# EAGLE design iridium-9602-breakout (EAGLE 9.2.2)
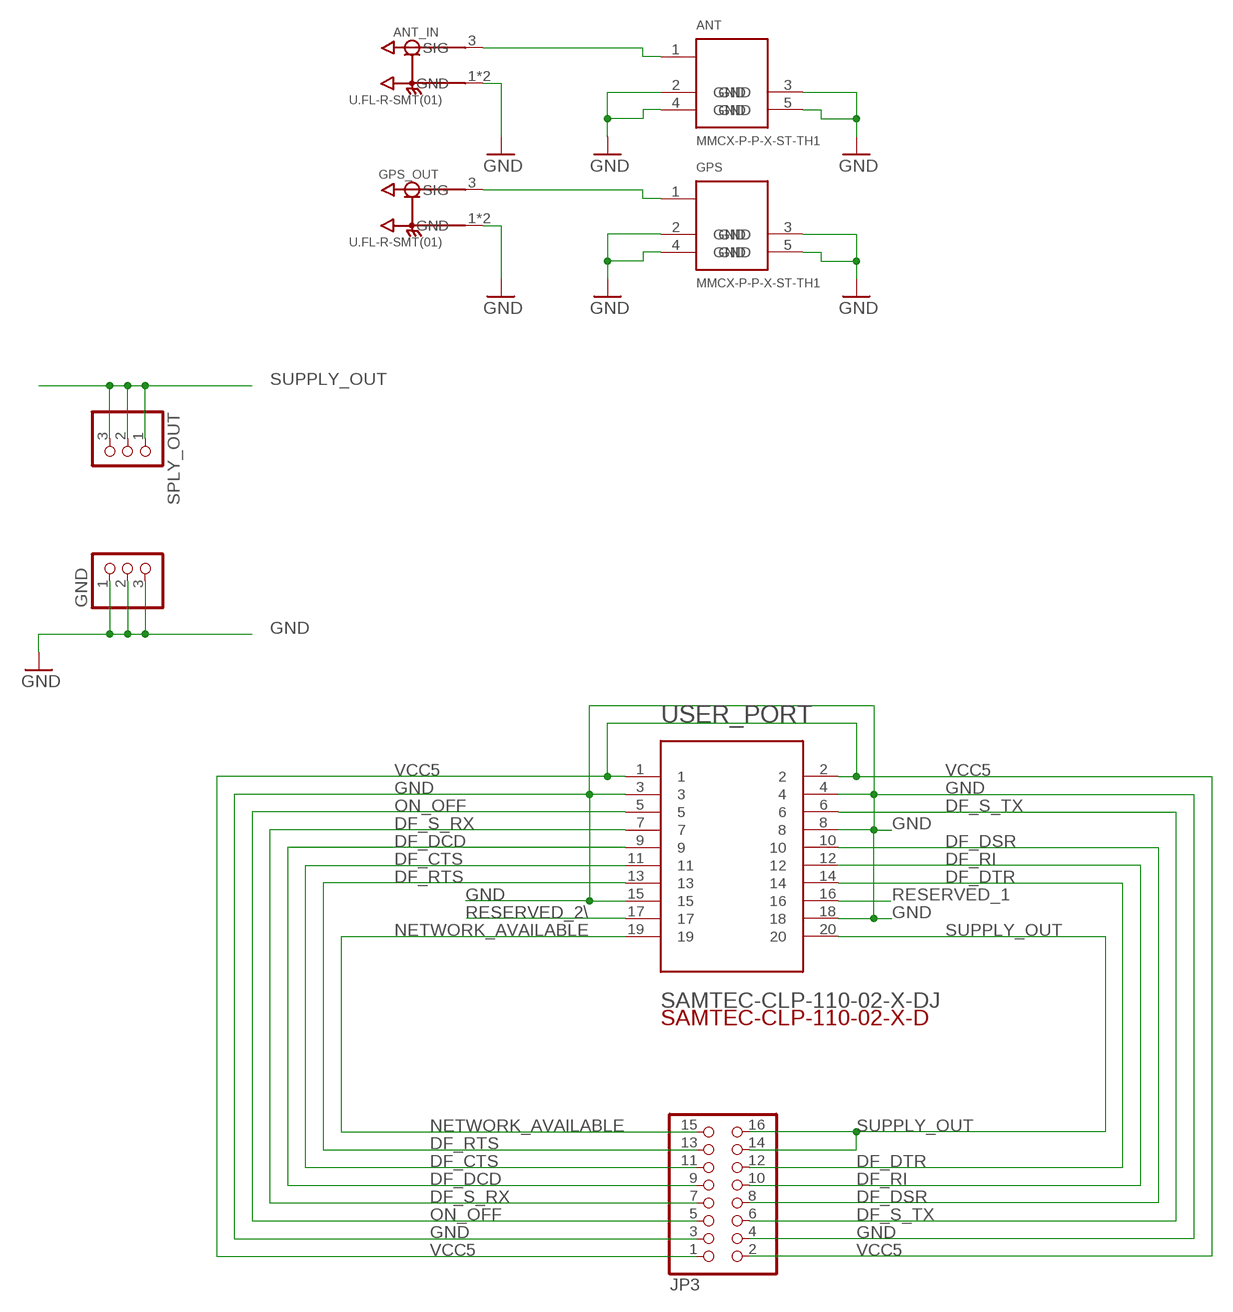
[diagram p0: schematic, sheet 1]

## Parts
ANT  MMCX-P-P-X-ST-TH1  [MMCX-P-P-X-ST-TH1]
ANT_IN  U.FL-R-SMT(01)  [HRS_U.FL-R-SMT(01)]
GND  PINHD-1X3  [1X03]
GPS  MMCX-P-P-X-ST-TH1  [MMCX-P-P-X-ST-TH1]
GPS_OUT  U.FL-R-SMT(01)  [HRS_U.FL-R-SMT(01)]
JP3  PINHD-2X8  [2X08]
SPLY_OUT  PINHD-1X3  [1X03]
USER_PORT  SAMTEC-CLP-110-02-X-DJ  [SAMTEC-CLP-110-02-X-D]

## Nets
DF_CTS: JP3.11 USER_PORT.11
DF_DCD: JP3.9 USER_PORT.9
DF_DSR: JP3.8 USER_PORT.10
DF_DTR: JP3.12 USER_PORT.14
DF_RI: JP3.10 USER_PORT.12
DF_RTS: JP3.13 USER_PORT.13
DF_S_RX: JP3.7 USER_PORT.7
DF_S_TX: JP3.6 USER_PORT.6
GND [power]: ANT.2(GND) ANT.3(GND) ANT.4(GND) ANT.5(GND) ANT_IN.1(GND) ANT_IN.2(GND) GND.1 GND.2 GND.3 GPS.2(GND) GPS.3(GND) GPS.4(GND) GPS.5(GND) GPS_OUT.1(GND) GPS_OUT.2(GND) JP3.3 JP3.4 USER_PORT.3 USER_PORT.4 USER_PORT.8 USER_PORT.15 USER_PORT.18
N$21 [rf]: ANT.1 ANT_IN.3(SIG)
N$22 [rf]: GPS.1 GPS_OUT.3(SIG)
NETWORK_AVAILABLE: JP3.15 USER_PORT.19
ON_OFF: JP3.5 USER_PORT.5
RESERVED_1: USER_PORT.16
RESERVED_2\: USER_PORT.17
SUPPLY_OUT: JP3.14 JP3.16 SPLY_OUT.1 SPLY_OUT.2 SPLY_OUT.3 USER_PORT.20
VCC5 [power]: JP3.1 JP3.2 USER_PORT.1 USER_PORT.2

## Library data of the parts
ANT GPS = MMCX-P-P-X-ST-TH1:MMCX-P-P-X-ST-TH1: MMCX STRAIGHT,THROUGH HOLE PLUG - 50 OHM.; DESCRIPTION: Conn MMCX PL 0Hz to 6GHz 50Ohm Solder ST Thru-Hole Gold Over Nickel; DIGI-KEY_PART_NUMBER: SAM10618-ND; DIGI-KEY_PURCHASE_URL: https://www.digikey.ru/product-detail/en/samtec-inc/MMCX-P-P-H-ST-TH1/SAM10618-ND/6561612?utm_source=snapeda&utm_medium=aggregator&utm_campaign=symbol; MF: Samtec Inc.; MP: MMCX-P-P-H-ST-TH1; PACKAGE: None
ANT_IN GPS_OUT = U.FL-R-SMT_01_:U.FL-R-SMT(01): U.FL Series 6 Ghz 50 Ohm Ultra-small SMT Coaxial Cable Receptacle; DESCRIPTION: U.FL Series 6 Ghz 50 Ohm Ultra-small SMT Coaxial Cable Receptacle; DIGI-KEY_PART_NUMBER: H9161-ND; DIGI-KEY_PURCHASE_URL: https://www.digikey.ru/product-detail/en/hirose-electric-co-ltd/U.FL-R-SMT_01_/H9161-ND/513010?utm_source=snapeda&utm_medium=aggregator&utm_campaign=symbol; MF: Hirose; MP: U.FL-R-SMT_01_; PACKAGE: None
GND SPLY_OUT = pinhead:PINHD-1X3: PIN HEADER
JP3 = pinhead:PINHD-2X8: PIN HEADER
USER_PORT = SAMTEC-CLP-110-02-X-D:SAMTEC-CLP-110-02-X-D; DESCRIPTION: .050 Tiger Claw™ Rugged Reliable Dual Wipe Socket Strip; DIGI-KEY_PART_NUMBER: CLP-110-02-L-D-K-ND; DIGI-KEY_PURCHASE_URL: https://www.digikey.ru/product-detail/en/samtec-inc/CLP-110-02-L-D-K/CLP-110-02-L-D-K-ND/6693709?utm_source=snapeda&utm_medium=aggregator&utm_campaign=symbol; MF: Samtec Inc.; MP: CLP-110-02-L-D-K; PACKAGE: None

## Net classes
0 default: width 0.2 mm, clearance 0.2 mm
1 power: width 0.5 mm, clearance 0.2 mm
2 rf: width 0.5 mm, clearance 0.065 mm

## Board
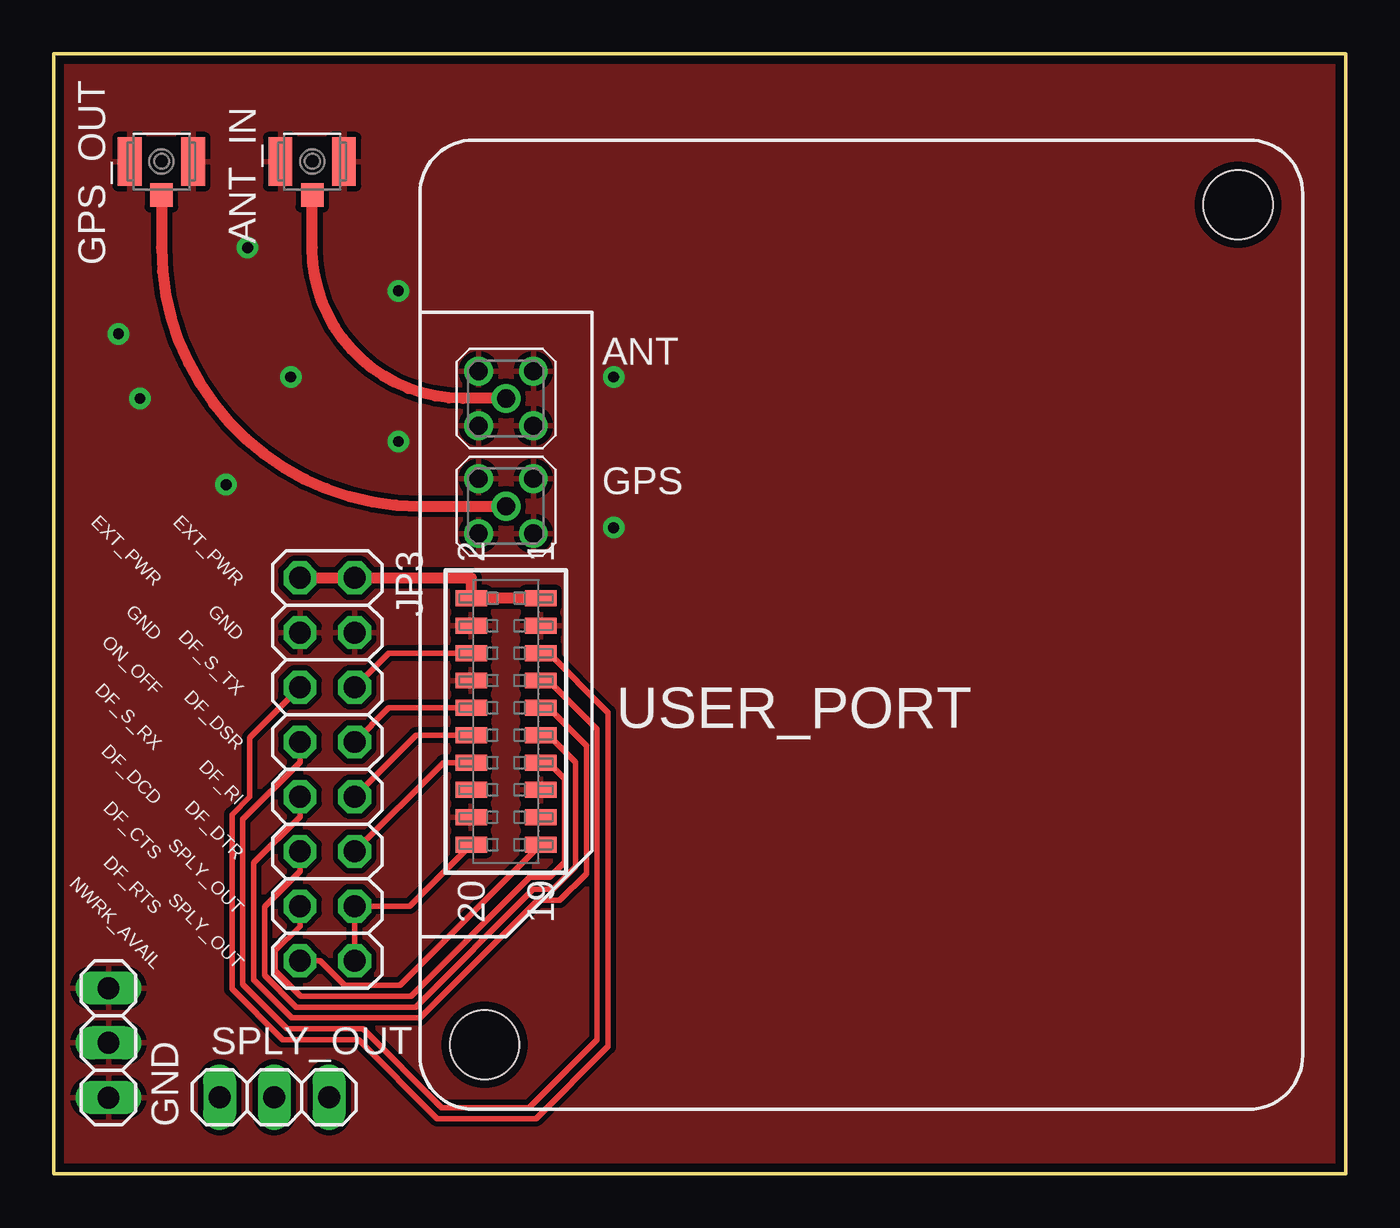
[diagram p1: board, top side]
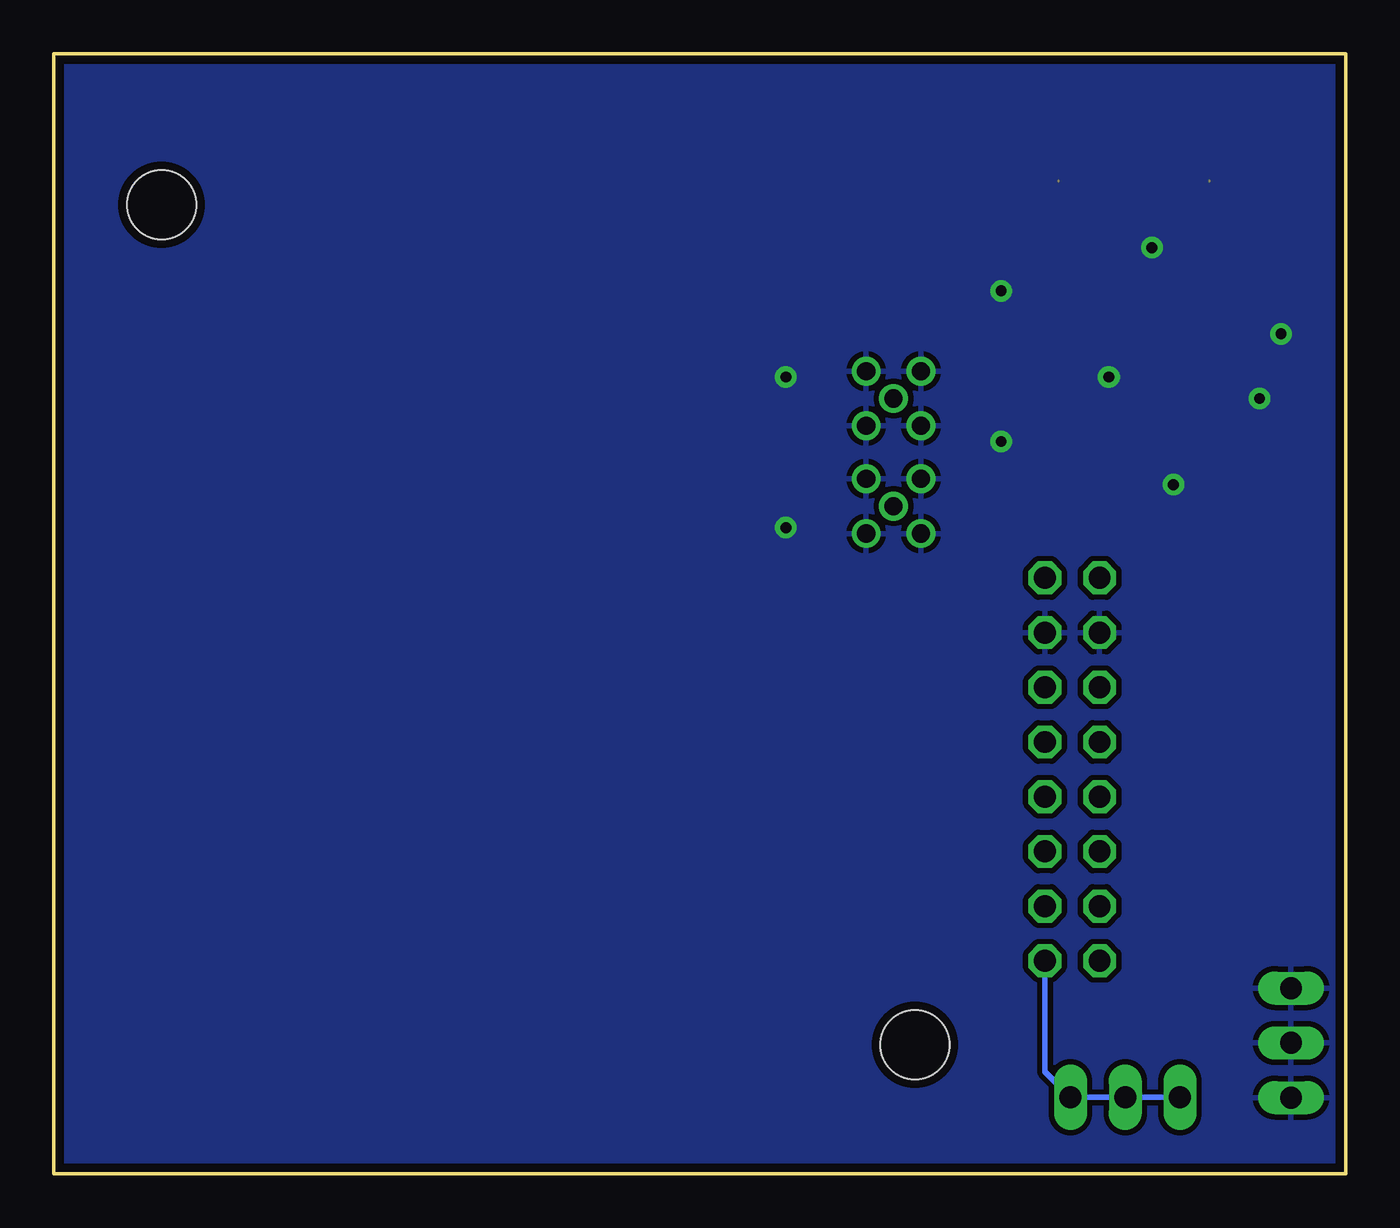
[diagram p2: board, bottom side, seen from below]

Size 60 x 52 mm. Coordinates in mm from the lower left corner, seen from the top.
Outline: 0,52 60,52 60,0 0,0 0,52
Copper layers (1*16): Top 0.035mm / dielectric 1mm / Bottom 0.035mm
Design rules "rezonit *": minimum track width 0.2mm, minimum drill 0.5mm, track to track 0.25mm, track to pad 0.25mm, pad to pad 0.25mm, via to via 0.25mm, smd to smd 0.2mm, copper to edge 0.4mm, drill to drill 0.4mm, minimum pad ring 0.25mm, minimum via ring 0.25mm, stop-mask expansion 4mil, vias tented up to drill 0mil, thermal gap 10mil
Holes 3.2 mm at 20,6 55,45

### Footprints (pad centres in the part's own frame; a part is rotated, then mirrored left to right if it is on the bottom)
MMCX-P-P-X-ST-TH1 = drill 0.84 pad 1.3: 1 0,0; 2 -1.27,1.27; 3 -1.27,-1.27; 4 1.27,1.27; 5 1.27,-1.27
HRS_U.FL-R-SMT(01) = smd 1.1 x 2.25: 1 -1.475,0; 2 1.475,0 | smd 1.05 x 1.1: 3 0,-1.55
1X03 = drill 1.016 long: 1 -2.54,0; 2 0,0; 3 2.54,0
2X08 = drill 1.016 octagon: 1 -8.89,-1.27; 2 -8.89,1.27; 3 -6.35,-1.27; 4 -6.35,1.27; 5 -3.81,-1.27; 6 -3.81,1.27; 7 -1.27,-1.27; 8 -1.27,1.27; 9 1.27,-1.27; 10 1.27,1.27; 11 3.81,-1.27; 12 3.81,1.27; 13 6.35,-1.27; 14 6.35,1.27; 15 8.89,-1.27; 16 8.89,1.27
SAMTEC-CLP-110-02-X-D = smd 0.74 x 1.47: 1 -5.715,1.613; 2 -5.715,-1.613; 3 -4.445,1.613; 4 -4.445,-1.613; 5 -3.175,1.613; 6 -3.175,-1.613; 7 -1.905,1.613; 8 -1.905,-1.613; 9 -0.635,1.613; 10 -0.635,-1.613; 11 0.635,1.613; 12 0.635,-1.613; 13 1.905,1.613; 14 1.905,-1.613; 15 3.175,1.613; 16 3.175,-1.613; 17 4.445,1.613; 18 4.445,-1.613; 19 5.715,1.613; 20 5.715,-1.613

### Placement (x,y rotation side)
ANT  21,36 0 top
ANT_IN  12,47 0 top
GND  2.54,6.08 90 top
GPS  21,31 0 top
GPS_OUT  5,47 0 top
JP3  12.7,18.78 270 top
SPLY_OUT  10.24,3.56 180 top
USER_PORT  21,21 270 top

### Tracks (layer width: path | path; a pad name or v marks a point on that pad's centre or on a via)
DF_CTS
  Top 0.254: USER_PORT.11 22.64,20.34 23,20.34 24.23,19.12 24.23,14.25 23.19,13.21 22.26,13.21 16.79,7.74 11.25,7.74 9.79,9.21 9.79,12.4 11.43,14.04 JP3.11
DF_DCD
  Top 0.254: USER_PORT.9 22.66,21.64 22.74,21.71 22.9,21.71 24.73,19.88 24.73,13.94 23.5,12.7 22.47,12.7 17,7.24 11.04,7.24 9.28,9 9.28,14.43 11.43,16.58 JP3.9
DF_DSR
  Top 0.254: USER_PORT.10 15.55,21.64 JP3.8
DF_DTR
  Top 0.254: USER_PORT.14 18.09,19.09 JP3.12
DF_RI
  Top 0.254: USER_PORT.12 16.82,20.36 JP3.10
DF_RTS
  Top 0.254: USER_PORT.13 22.64,19.07 23,19.07 23.73,18.35 23.73,14.46 23.03,13.77 22.1,13.77 16.58,8.25 11.46,8.25 10.29,9.42 10.29,10.36 11.43,11.5 JP3.13
DF_S_RX
  Top 0.254: USER_PORT.7 22.64,22.88 23,22.88 25.24,20.65 25.24,6.23 22.08,3.07 18.02,3.07 14.36,6.74 10.84,6.74 8.78,8.79 8.78,16.47 11.43,19.12 JP3.7
DF_S_TX
  Top 0.254: USER_PORT.6 15.55,24.18 JP3.6
GND  (via drill 0.5)
  other vias: 3,39 4,36 9,43 11,37 16,41 16,34 26,30 26,37 8,32
  pour Bottom: 60,0 60,52 0,52 0,0
  pour Top: 0,0 60,0 60,52 0,52
N$21
  Top 0.5: ANT.1 19,36 arc-90 12,43 ANT_IN.3
N$22
  Top 0.5: GPS_OUT.3 5,43 arc90 17,31 GPS.1
NETWORK_AVAILABLE
  Top 0.254: JP3.15 12.36,9.89 13.5,8.75 16.08,8.75 USER_PORT.19
ON_OFF
  Top 0.254: USER_PORT.5 22.69,24.25 22.9,24.25 25.74,21.41 25.74,5.92 22.39,2.57 17.81,2.57 14.15,6.23 10.63,6.23 8.28,8.58 8.28,16.68 9.1,17.5 9.1,20.26 JP3.5
SUPPLY_OUT
  Top 0.254: USER_PORT.20 16.53,12.43 14,12.43 | 14,12.43 JP3.14 | JP3.16 13.97,12.4 14,12.43
  Bottom 0.254: JP3.16 13.97,4.75 SPLY_OUT.1 SPLY_OUT.2 SPLY_OUT.3
VCC5
  Top 0.5: USER_PORT.1 USER_PORT.2 19.39,27.67 JP3.2 JP3.1

### Text on the board
tNames: EXT_PWR | EXT_PWR | GND | GND | ON_OFF | DF_S_TX | DF_S_RX | DF_DSR | DF_DCD | DF_RI | DF_CTS | DF_DTR | DF_RTS | SPLY_OUT | NWRK_AVAIL | SPLY_OUT